# Altium schematic sheet FRAM.SchDoc
size A4; CompanyName: HESSO; Address1: Route du Rawyl 47; Address2: 1950 Sion; Address3: Switzerland; DocumentNumber: 3; SheetNumber: 1; SheetTotal: 1; PageSetup: Record=PageOptions|CenterHorizontal=True|CenterVertical=True|PrintScale=1.00|XCorrection=1.00|YCorrection=1.00|PrintKind=1|BorderSize=5000000|LeftOffset=0|BottomOffset=0|Orientation=2|PaperLength=1000|PaperWidth=1000|Scale=100|PaperSource=15|PrintQuality=1200|MediaType=1|DitherType=10|PrintScaleMode=1|PaperKind=A4|PaperIndex=9; ProjectName: Project Name
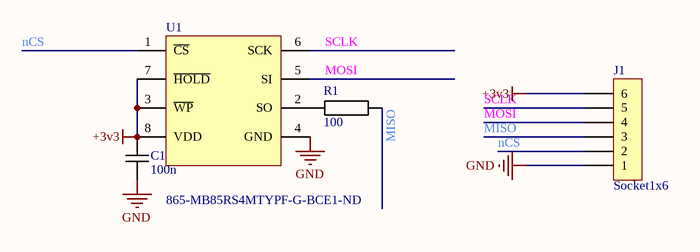
[diagram p0: FRAM.SchDoc]

## Parts
C1  100n  [CAPACITOR 2012 REFLOW]
J1  Socket1x6  [Socket1x6 P2.54]
R1  100  [RESISTOR 2012 REFLOW]
U1  865-MB85RS4MTYPF-G-BCE1-ND  [SO8W P1.27 C5.0X5.0 H2.0]

## Nets
+3v3: C1.2 J1.6 U1.3(~{WP}) U1.7(~{HOLD}) U1.8(VDD)
GND: C1.1 J1.1 U1.4(GND)
MISO: J1.3 R1.2
MOSI: J1.4 U1.5(SI)
nCS: J1.2 U1.1(~{CS})
SCLK: J1.5 U1.6(SCK)
NetR1_1: R1.1 U1.2(SO)

## Notes on the sheet
- Date :
- Revision :
- Sheet
- of
- Design by :

## Library data of the parts
C1 = Capacitor: Value: 100n
J1 = Socket1x6: Receptacle connector
R1 = Resistor: Value: 100
U1 = FM25V20A-G: 2-Mbit (256 K × 8) Serial (SPI) F-RAM; Value: 865-MB85RS4MTYPF-G-BCE1-ND